# EAGLE schematic capbot (EAGLE 7.5.0)
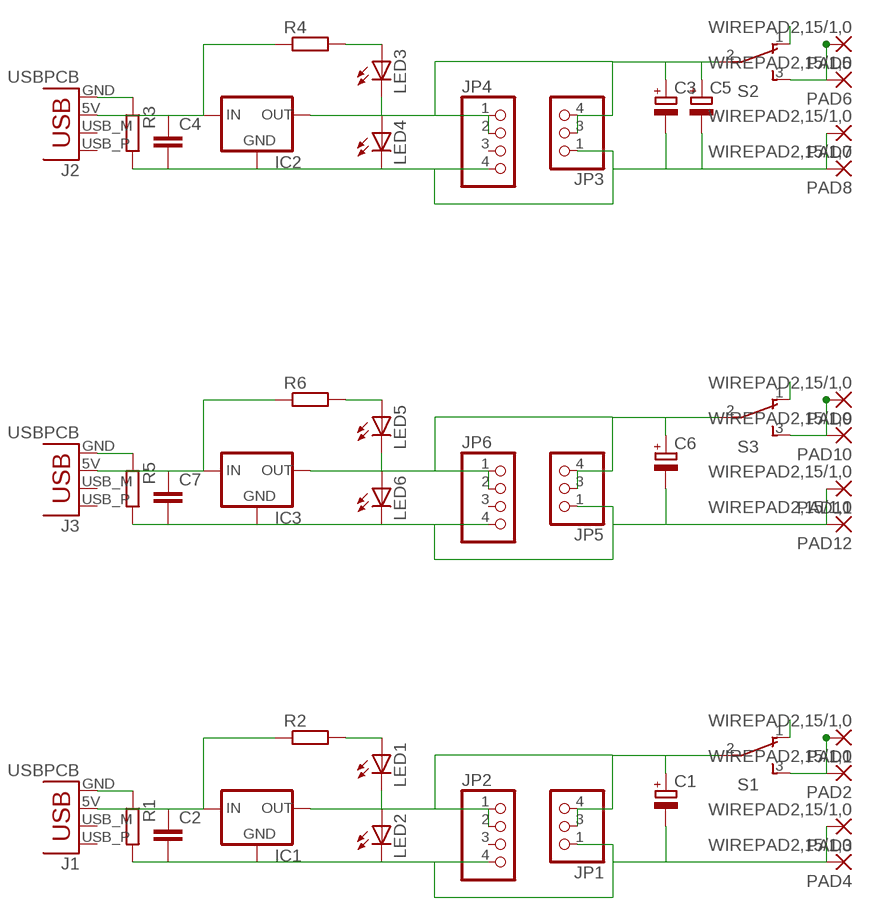
[diagram p0: schematic, sheet 1]

## Parts
C1  CPOL-EUE5-10.5  [E5-10,5]
C2  C-EUC1206  [C1206]
C3  CPOL-EUE5-10.5  [E5-10,5]
C4  C-EUC1206  [C1206]
C5  CPOL-EUE5-10.5  [E5-10,5]
C6  CPOL-EUE5-10.5  [E5-10,5]
C7  C-EUC1206  [C1206]
IC1  MCP1700INLINE  [TO92-INLINE]
IC2  MCP1700INLINE  [TO92-INLINE]
IC3  MCP1700INLINE  [TO92-INLINE]
J1  USBPCB  [USB-A-PCB]
J2  USBPCB  [USB-A-PCB]
J3  USBPCB  [USB-A-PCB]
JP1  PINHD-1X3-4GAP  [1X04/GAP2]
JP2  PINHD-1X4  [1X04/OFFSETDOWN]
JP3  PINHD-1X3-4GAP  [1X04/GAP2]
JP4  PINHD-1X4  [1X04/OFFSETDOWN]
JP5  PINHD-1X3-4GAP  [1X04/GAP2]
JP6  PINHD-1X4  [1X04/OFFSETDOWN]
LED1  LED3MM-MOREFLAT  [LED3MM-MOREFLAT]
LED2  LED3MM-MOREFLAT  [LED3MM-MOREFLAT]
LED3  LED3MM-MOREFLAT  [LED3MM-MOREFLAT]
LED4  LED3MM-MOREFLAT  [LED3MM-MOREFLAT]
LED5  LED3MM-MOREFLAT  [LED3MM-MOREFLAT]
LED6  LED3MM-MOREFLAT  [LED3MM-MOREFLAT]
PAD1  WIREPAD2,15/1,0  [2,15/1,0]
PAD2  WIREPAD2,15/1,0  [2,15/1,0]
PAD3  WIREPAD2,15/1,0  [2,15/1,0]
PAD4  WIREPAD2,15/1,0  [2,15/1,0]
PAD5  WIREPAD2,15/1,0  [2,15/1,0]
PAD6  WIREPAD2,15/1,0  [2,15/1,0]
PAD7  WIREPAD2,15/1,0  [2,15/1,0]
PAD8  WIREPAD2,15/1,0  [2,15/1,0]
PAD9  WIREPAD2,15/1,0  [2,15/1,0]
PAD10  WIREPAD2,15/1,0  [2,15/1,0]
PAD11  WIREPAD2,15/1,0  [2,15/1,0]
PAD12  WIREPAD2,15/1,0  [2,15/1,0]
R1  R-EU_0207/7  [0207/7]
R2  R-EU_0207/5V  [0207/5V]
R3  R-EU_0207/7  [0207/7]
R4  R-EU_0207/5V  [0207/5V]
R5  R-EU_0207/7  [0207/7]
R6  R-EU_0207/5V  [0207/5V]
S1  TL36PO  [TL3XPO]
S2  TL36PO  [TL3XPO]
S3  TL36PO  [TL3XPO]

## Nets
N$1: C1.- C2.2 IC1.1(GND) JP1.1 JP2.4 LED2.K(C) PAD3.1(P) PAD4.1(P) R1.2
N$2: C1.+ IC1.3(OUT) JP1.3 JP1.4 JP2.1 JP2.2 S1.2(P)
N$3: PAD1.1(P) PAD2.1(P) S1.3(S)
N$4: J1.GND R1.1
N$6: C2.1 IC1.2(IN) J1.5V(VBUS) R2.1
N$8: LED1.A R2.2
N$9: LED1.K(C) LED2.A
N$10: S1.1(O)
N$11: C3.- C4.2 C5.- IC2.1(GND) JP3.1 JP4.4 LED4.K(C) PAD7.1(P) PAD8.1(P) R3.2
N$12: C3.+ C5.+ IC2.3(OUT) JP3.3 JP3.4 JP4.1 JP4.2 S2.2(P)
N$13: PAD5.1(P) PAD6.1(P) S2.3(S)
N$14: J2.GND R3.1
N$16: C4.1 IC2.2(IN) J2.5V(VBUS) R4.1
N$18: LED3.A R4.2
N$19: LED3.K(C) LED4.A
N$20: S2.1(O)
N$21: C6.- C7.2 IC3.1(GND) JP5.1 JP6.4 LED6.K(C) PAD11.1(P) PAD12.1(P) R5.2
N$22: C6.+ IC3.3(OUT) JP5.3 JP5.4 JP6.1 JP6.2 S3.2(P)
N$23: PAD9.1(P) PAD10.1(P) S3.3(S)
N$24: J3.GND R5.1
N$26: C7.1 IC3.2(IN) J3.5V(VBUS) R6.1
N$28: LED5.A R6.2
N$29: LED5.K(C) LED6.A
N$30: S3.1(O)
Unconnected: J1.USB_M(D-) J1.USB_P(D+) J2.USB_M(D-) J2.USB_P(D+) J3.USB_M(D-) J3.USB_P(D+) JP2.3 JP4.3 JP6.3

## Library data of the parts
C1 C3 C5 C6 = resistor:CPOL-EU: POLARIZED CAPACITOR, European symbol
C2 C4 C7 = resistor:C-EU: CAPACITOR, European symbol
IC1-IC3 = adafruit:MCP1700: VOLTAGE REGULATOR
J1-J3 = SparkFun-Connectors:USB: USB Connectors USB-B-PTH is fully proven SKU : PRT-00139/CONN-08278 USB-miniB is fully proven SKU : PRT-00587 USB-A-PCB is untested. USB-A-H is throughly reviewed, but untested. Spark Fun Electronics SKU : PRT-00437 USB-B-SMT is throughly reviewed, but untested. Needs silkscreen touching up. USB-A-S has not been used/tested USB-MB-H has not been used/tested USB-MICROB has been used. CONN-09505
JP1 JP3 JP5 = cwpinhead:PINHD-1X3-4GAP: PIN HEADER
JP2 JP4 JP6 = cwpinhead:PINHD-1X4: PIN HEADER
LED1-LED6 = cwpackage:LED: LED OSRAM: - CHIPLED LG R971, LG N971, LY N971, LG Q971, LY Q971, LO R971, LY R971 LH N974, LH R974 LS Q976, LO Q976, LY Q976 LO Q996 - Hyper CHIPLED LW Q18S LB Q993, LB Q99A, LB R99A - SideLED LS A670, LO A670, LY A670, LG A670, LP A670 LB A673, LV A673, LT A673, LW A673 LH A674 LY A675 LS A676, LA A676, LO A676, LY A676, LW A676 LS A679, LY A679, LG A679 - Hyper Micro SIDELED® LS Y876, LA Y876, LO Y876, LY Y876 LT Y87S - SmartLED LW L88C, LW L88S LB L89C, LB L89S, LG L890 LS L89K, LO L89K, LY L89K LS L896, LA L896, LO L896, LY L896 - TOPLED LS T670, LO T670, LY T670, LG T670, LP T670 LSG T670, LSP T670, LSY T670, LOP T670, LYG T670 LG T671, LOG T671, LSG T671 LB T673, LV T673, LT T673, LW T673 LH T674 LS T676, LA T676, LO T676, LY T676, LB T676, LH T676, LSB T676, LW T676 LB T67C, LV T67C, LT T67C, LS T67K, LO T67K, LY T67K, LW E67C LS E67B, LA E67B, LO E67B, LY E67B, LB E67C, LV E67C, LT E67C LW T67C LS T679, LY T679, LG T679 LS T770, LO T770, LY T770, LG T770, LP T770 LB T773, LV T773, LT T773, LW T773 LH T774 LS E675, LA E675, LY E675, LS T675 LS T776, LA T776, LO T776, LY T776, LB T776 LHGB T686 LT T68C, LB T68C - Hyper Mini TOPLED® LB M676 - Mini TOPLED Santana® LG M470 LS M47K, LO M47K, LY M47K Source: http://www.osram.convergy.de LUXEON: - LUMILED® LXK2-PW12-R00, LXK2-PW12-S00, LXK2-PW14-U00, LXK2-PW14-V00 LXK2-PM12-R00, LXK2-PM12-S00, LXK2-PM14-U00 LXK2-PE12-Q00, LXK2-PE12-R00, LXK2-PE12-S00, LXK2-PE14-T00, LXK2-PE14-U00 LXK2-PB12-K00, LXK2-PB12-L00, LXK2-PB12-M00, LXK2-PB14-N00, LXK2-PB14-P00, LXK2-PB14-Q00 LXK2-PR12-L00, LXK2-PR12-M00, LXK2-PR14-Q00, LXK2-PR14-R00 LXK2-PD12-Q00, LXK2-PD12-R00, LXK2-PD12-S00 LXK2-PH12-R00, LXK2-PH12-S00 LXK2-PL12-P00, LXK2-PL12-Q00, LXK2-PL12-R00 Source: www.luxeon.com KINGBRIGHT: KA-3528ASYC Source: www.kingbright.com
PAD1-PAD12 = wirepad:WIREPAD: Wire PAD connect wire on PCB
R1-R6 = resistor:R-EU_: RESISTOR, European symbol
S1-S3 = switch:TL36PO: TINY SWITCH ON - ON Source: http://www2.produktinfo.conrad.com/datenblaetter/700000-724999/705152-da-01-de-Subminiaturschalter_TL_36YO.pdf

## Net classes
0 default: clearance 0.205 mm